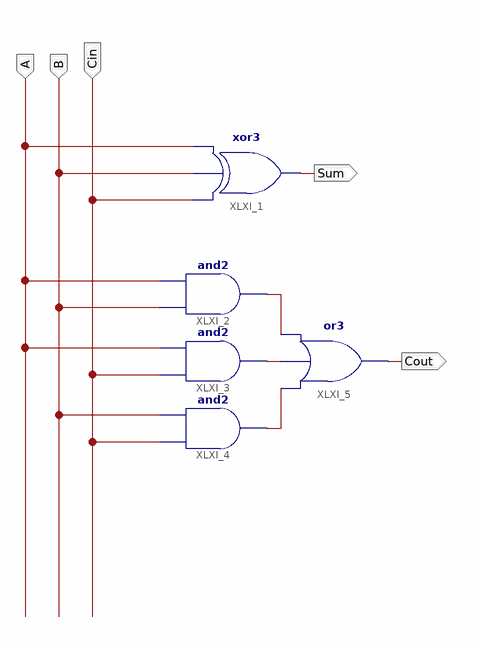
[diagram p0: schematic sheet 1]
// Xilinx ISE schematic full_adder_1bits.sch (spartan6) as structural Verilog: 5 symbols, 5 ports
module full_adder_1bits (
  input  A,
  input  B,
  input  Cin,
  output Sum,
  output Cout
);

  wire XLXN_5, XLXN_6, XLXN_7;

  xor XLXI_1 (Sum, Cin, B, A);
  and XLXI_2 (XLXN_6, B, A);
  and XLXI_3 (XLXN_5, Cin, A);
  and XLXI_4 (XLXN_7, Cin, B);
  or XLXI_5 (Cout, XLXN_7, XLXN_5, XLXN_6);
endmodule
